# Altium schematic sheet OSCILLAR_HFB_V1p0_LFPS.SchDoc
size A4; SheetNumber: 7; SheetTotal: 11; Title_: Low Frequency Path Switch
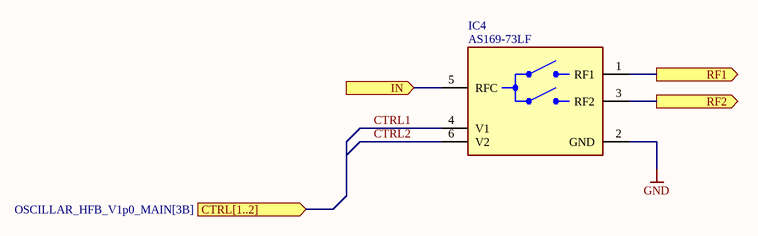
[diagram p0: OSCILLAR_HFB_V1p0_LFPS.SchDoc]

## Parts
IC4  AS169-73LF  [SOT-23-6]

## Ports
CTRL[1..2] (in, see OSCILLAR_HFB_V1p0_MAIN[3B]), IN (in, see OSCILLAR_HFB_V1p0_MAIN[3A]), RF1 (out, see OSCILLAR_HFB_V1p0_MAIN[4A]), RF2 (out, see OSCILLAR_HFB_V1p0_MAIN[4B])

## Nets
GND: IC4.2(GND)
CTRL1: IC4.4(V1)
CTRL2: IC4.6(V2)
IN: IC4.5(RFC) ; port IN
RF1: IC4.1(RF1) ; port RF1
RF2: IC4.3(RF2) ; port RF2

## Notes on the sheet
- Board:
- Author:
- Title:
- Project:
- SVN:
- Version:
- Sheet:
- of
- Contact:
- Modified:
- Size:
- A4

## Library data of the parts
IC4 = AS169-73LF: RF Switch, SPDT, 300k-2.5GHz; Part number: 873-AS169-73LF; Supplier: Mouser; Type: IC; ComponentLink1Description: Datasheet; ComponentLink1URL: AS169_200105E-3365381; ComponentLink2Description: Order; ComponentLink2URL: https://eu.mouser.com/ProductDetail/Skyworks-Solutions-Inc/AS169-73LF?qs=WMHGlxXAKT9QQcX4VtVmzg%3D%3D